# Altium schematic sheet TPS55340_Adjustable_SEPIC_Converter.SchDoc: +8V...20V Output SEPIC Converter
size A4
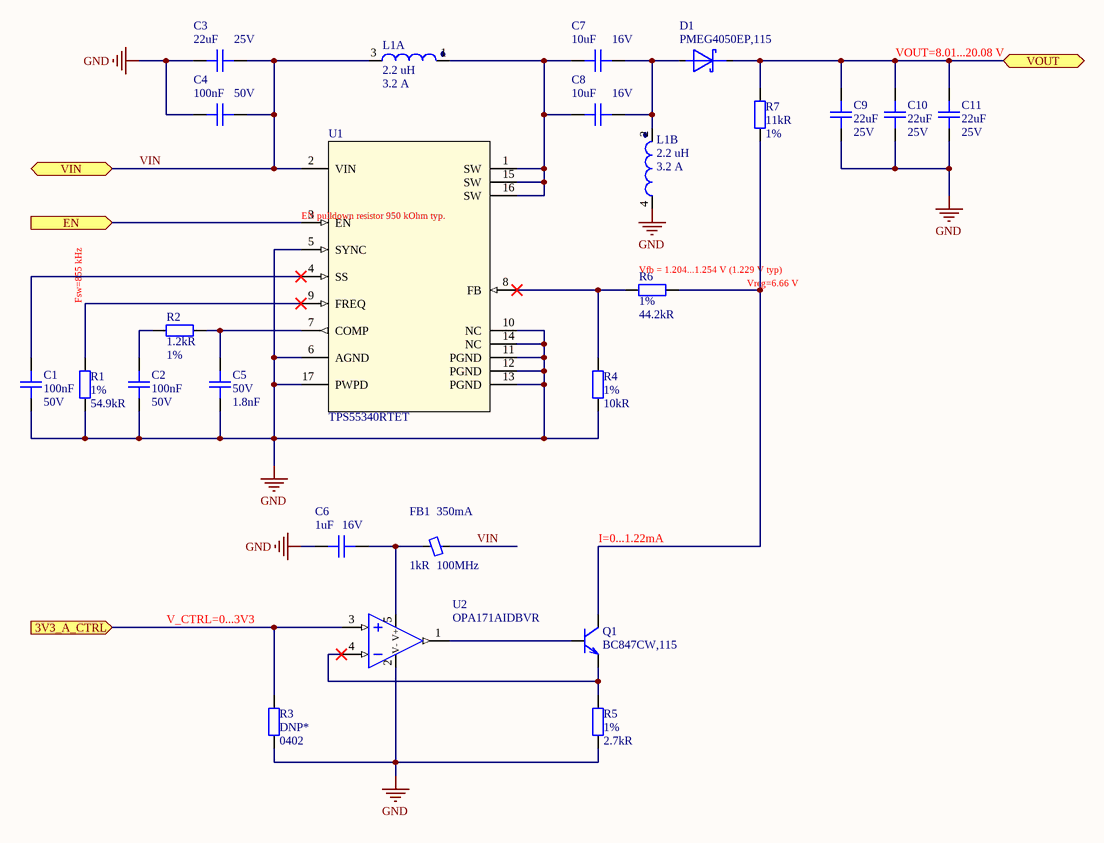
[diagram p0: TPS55340_Adjustable_SEPIC_Converter.SchDoc]

## Parts
C1  Capacitance: 100nF  Voltage: 50V  [C0402]  (hidden comment: CAP CER 0.1UF 50V X7R 0402)
C2  Capacitance: 100nF  Voltage: 50V  [C0402]  (hidden comment: CAP CER 0.1UF 50V X7R 0402)
C3  Capacitance: 22uF  Voltage Rating: 25V  [C0805]  (hidden comment: CAP CER 22UF 25V X5R 0805)
C4  Capacitance: 100nF  Voltage: 50V  [C0402]  (hidden comment: CAP CER 0.1UF 50V X7R 0402)
C5  Voltage Rating (DC): 50V  Capacitance: 1.8nF  [C0402]  (hidden comment: CAP CER 1800PF 50V X7R 0402)
C6  Capacitance: 1uF  Voltage Rating: 16V  [C0402]  (hidden comment: CAP CER 1UF 16V X5R 0402)
C7  Capacitance: 10uF  Voltage Rating: 16V  [C0805]  (hidden comment: CAP CER 10UF 16V X7R 0805)
C8  Capacitance: 10uF  Voltage Rating: 16V  [C0805]  (hidden comment: CAP CER 10UF 16V X7R 0805)
C9  Capacitance: 22uF  Voltage Rating: 25V  [C0805]  (hidden comment: CAP CER 22UF 25V X5R 0805)
C10  Capacitance: 22uF  Voltage Rating: 25V  [C0805]  (hidden comment: CAP CER 22UF 25V X5R 0805)
C11  Capacitance: 22uF  Voltage Rating: 25V  [C0805]  (hidden comment: CAP CER 22UF 25V X5R 0805)
D1  PMEG4050EP,115  [SOD-128]
FB1  Impedance: 1kR  Max DC Current: 350mA  Test Frequency: 100MHz  [L0402]  (hidden comment: FERRITE BEAD 1 KOHM 0402 1LN)
L1  Inductance: 2.2 uH  Maximum DC Current: 3.2 A  [IND_MSD1048H]  (hidden comment: FIXED IND COUIPLED 2.2UH 3.2A 22 MOHM SMD)  (parts A,B of 2)
Q1  BC847CW,115  [SOT-323]
R1  Tolerance: 1%  Resistance: 54.9kR  [R0402]  (hidden comment: RES SMD 54.9K OHM 1% 1/16W 0402)
R2  Resistance: 1.2kR  Tolerance: 1%  [R0402]  (hidden comment: RES SMD 1.2K OHM 1% 1/16W 0402)
R3  DNP*  Case/Package: 0402  [R0402]  (no BOM)
R4  Tolerance: 1%  Resistance: 10kR  [R0402]  (hidden comment: RES SMD 10K OHM 1% 1/16W 0402)
R5  Tolerance: 1%  Resistance: 2.7kR  [R0402]  (hidden comment: RES SMD 2.7K OHM 1% 1/16W 0402)
R6  Tolerance: 1%  Resistance: 44.2kR  [R0402]  (hidden comment: RES SMD 44.2K OHM 1% 1/16W 0402)
R7  Resistance: 11kR  Tolerance: 1%  [R0402]  (hidden comment: RES SMD 11K OHM 1% 1/16W 0402)
U1  TPS55340RTET  [RTE0016C]
U2  OPA171AIDBVR  [SOT-23-5]

## Ports
3V3_A_CTRL (in), EN (in), VIN, VOUT

## Nets
GND: C1.1 C2.1 C3.1 C4.1 C5.1 C6.1 C9.1 C10.1 C11.1 L1.4 R1.1 R3.2 R4.2 R5.1 U1.5(SYNC) U1.6(AGND) U1.10(NC) U1.11(PGND) U1.12(PGND) U1.13(PGND) U1.14(NC) U1.17(PWPD) U2.2(V-)
3V3_A_CTRL: R3.1 U2.3(IN+) ; port 3V3_A_CTRL
EN: U1.3(EN) ; port EN
VIN: C3.2 C4.2 FB1.1 L1.3 U1.2(VIN) ; port VIN
VOUT: C9.2 C10.2 C11.2 D1.1(K) R7.2 ; port VOUT
NetC1_2: C1.2 U1.4(SS)
NetC2_2: C2.2 R2.1
NetC5_2: C5.2 R2.2 U1.7(COMP)
NetC6_2: C6.2 FB1.2 U2.5(V+)
NetC7_1: C7.1 C8.1 L1.1 U1.1(SW) U1.15(SW) U1.16(SW)
NetC7_2: C7.2 C8.2 D1.2(A) L1.2
NetQ1_1: Q1.1(B) U2.1(OUT)
NetQ1_2: Q1.2(E) R5.2 U2.4(IN-)
NetQ1_3: Q1.3(C) R6.1 R7.1
NetR1_2: R1.2 U1.9(FREQ)
NetR4_1: R4.1 R6.2 U1.8(FB)

## Notes on the sheet
- VOUT=8.01...20.08 V
- (near U1) EN pulldown resistor 950 kOhm typ.
- (near R1) Fsw=855 kHz
- (near U1) Vfb = 1.204...1.254 V (1.229 V typ)
- (near R6) Vreg=6.66 V
- I=0...1.22mA
- V_CTRL=0...3V3
- Title
- Size:
- Date:
- A4
- Number:
- Time:
- Revision:
- Sheet
- of
- File:

## Library data of the parts
C1 C2 C4 = CAP CER 0.1UF 50V X7R 0402: 0.1µF ±10% 50V Ceramic Capacitor X7R 0402 (1005 Metric); Manufacturer: TDK; Manufacturer Part Number: CGA2B3X7R1H104K050BB; Supplier 1: Digi-Key; Stock 1: 2925303; Pricing 1: 1=0.17, 10=0.118, 50=0.0668, 100=0.0553, 500=0.0388, 1000=0.0321, 2500=0.0299, 5000=0.0273 (USD); Case/Package: 0402; Case Code (Imperial): 0402; Case Code (Metric): 1005; Min Operating Temperature: -55°C; Max Operating Temperature: 125°C; Packaging: Tape and Reel; Voltage Rating (DC): 50V; Package Quantity: 1; Voltage Rating: 50V; Termination: SMD/SMT; Composition: Ceramic; Length: 1mm; Height: 0.5mm; Width: 0.02inch; Depth: 0.5mm; Lead Free: Lead Free; ComponentLink1URL: http://product.tdk.com/capacitor/mlcc/en/documents/mlccspec_automotive_general_midvoltage_en.pdf?src-supplier=Future+Electronics; ComponentLink1Description: http://product.tdk.com/capacitor/mlcc/en/documents/mlccspec_automotive_general_midvoltage_en.pdf?src-supplier=Future+Electronics; Supplier Part Number 1: 445-6899-1-ND; Tolerance: 10%; Mount: Surface Mount; Weight: 2.3E-05oz; Dielectric: X7R; Thickness: 0.022inch; Ratings: AEC-Q200; REACH SVHC: No SVHC; ComponentLink2URL: http://www.farnell.com/datasheets/1807242.pdf?src-supplier=Element14; ComponentLink2Description: http://www.farnell.com/datasheets/1807242.pdf?src-supplier=Element14; ComponentLink3URL: http://www.mouser.com/ds/2/400/lcc_automotive_general_en-843974.pdf?src-supplier=Mouser; ComponentLink3Description: http://www.mouser.com/ds/2/400/lcc_automotive_general_en-843974.pdf?src-supplier=Mouser; ComponentLink4URL: http://www.farnell.com/datasheets/1936565.pdf?src-supplier=Element14; ComponentLink4Description: http://www.farnell.com/datasheets/1936565.pdf?src-supplier=Element14; ComponentLink5URL: http://www.farnell.com/datasheets/1735392.pdf?src-supplier=Element14; ComponentLink5Description: http://www.farnell.com/datasheets/1735392.pdf?src-supplier=Element14
C3 C9-C11 = CAP CER 22UF 25V X5R 0805: 22µF ±20% 25V Ceramic Capacitor X5R 0805 (2012 Metric); Manufacturer: Yageo; Manufacturer Part Number: CC0805MKX5R8BB226; Supplier 1: Digi-Key; Stock 1: 1060; Pricing 1: 1=0.5, 10=0.353, 50=0.267, 100=0.2325, 500=0.1722, 1000=0.1464 (USD); Mount: Surface Mount; Case/Package: 0805; Weight: 0.000194oz; Case Code (Metric): 2012; Case Code (Imperial): 0805; Min Operating Temperature: -55°C; Max Operating Temperature: 85°C; Packaging: Tape and Reel; Tolerance: 20%; Dielectric: X5R; Termination: SMD/SMT; Voltage Rating (DC): 25V; Package Quantity: 3000; Length: 0.079inch; Height: 1.25mm; Width: 0.049inch; Thickness: 0.057inch; Lead Free: Lead Free; Halogen Free: Halogen Free; ComponentLink1URL: http://www.yageo.com/documents/recent/UPY-GPHC_X5R_4V-to-50V_25.pdf?src-supplier=Digi-Key; ComponentLink1Description: http://www.yageo.com/documents/recent/UPY-GPHC_X5R_4V-to-50V_25.pdf?src-supplier=Digi-Key; ComponentLink2URL: http://www.mouser.com/ds/2/447/Yageo_UPY-GP_NP0_16V-to-50V_9-358835.pdf?src-supplier=Mouser; ComponentLink2Description: http://www.mouser.com/ds/2/447/Yageo_UPY-GP_NP0_16V-to-50V_9-358835.pdf?src-supplier=Mouser; Supplier Part Number 1: 311-1903-1-ND
C5 = CAP CER 1800PF 50V X7R 0402: 1800pF ±5% 50V Ceramic Capacitor X7R 0402 (1005 Metric); Manufacturer: KEMET; Manufacturer Part Number: C0402C182J5RACTU; Dissipation Factor: 2.5%; Supplier 1: Digi-Key; Stock 1: 45958; Pricing 1: 1=0.46, 10=0.322, 50=0.2438, 100=0.2124, 500=0.1573, 1000=0.1337, 2500=0.1258, 5000=0.118 (USD); Mount: Surface Mount; Case/Package: 0402; Case Code (Metric): 1005; Case Code (Imperial): 0402; Min Operating Temperature: -55°C; Max Operating Temperature: 125°C; Package Quantity: 1; Packaging: Tape and Reel; Tolerance: 5%; Dielectric: X7R; Termination: SMD/SMT; Length: 1mm; Height: 0.5mm; Width: 0.02inch; Thickness: 0.022inch; ComponentLink1URL: http://www.mouser.com/ds/2/212/KEM_C1002_X7R_SMD-1102033.pdf?src-supplier=Mouser; ComponentLink1Description: http://www.mouser.com/ds/2/212/KEM_C1002_X7R_SMD-1102033.pdf?src-supplier=Mouser; Supplier Part Number 1: 399-8953-1-ND; Voltage Rating: 50V; Dielectric Material: Ceramic; Depth: 0.5mm; REACH SVHC: No SVHC; Lead Pitch: 0.3mm; Radiation Hardening: No
C6 = CAP CER 1UF 16V X5R 0402: 1µF ±10% 16V Ceramic Capacitor X5R 0402 (1005 Metric); Manufacturer: Yageo; Manufacturer Part Number: CC0402KRX5R7BB105; Supplier 1: Digi-Key; Stock 1: 1114963; Pricing 1: 1=0.4, 10=0.278, 100=0.167, 500=0.1253, 1000=0.1058, 2500=0.1002, 5000=0.0947 (USD); Mount: Surface Mount; Case/Package: 0402; Weight: 2.3E-05oz; Case Code (Metric): 1005; Case Code (Imperial): 0402; Min Operating Temperature: -55°C; Max Operating Temperature: 85°C; Packaging: Tape and Reel; Tolerance: 10%; Voltage Rating (DC): 16V; Dielectric: X5R; Termination: SMD/SMT; Length: 1mm; Height: 0.5mm; Width: 0.02inch; Thickness: 0.022inch; Depth: 0.5mm; Lead Free: Lead Free; ComponentLink1URL: http://www.yageo.com/documents/recent/UPY-GPHC_X5R_4V-to-50V_12.pdf?src-supplier=Avnet+Europe; ComponentLink1Description: http://www.yageo.com/documents/recent/UPY-GPHC_X5R_4V-to-50V_12.pdf?src-supplier=Avnet+Europe; Supplier Part Number 1: 311-1691-1-ND; Composition: Ceramic; Radiation Hardening: No; Halogen Free: Halogen Free
C7 C8 = CAP CER 10UF 16V X7R 0805: 10µF ±10% 16V Ceramic Capacitor X7R 0805 (2012 Metric); Manufacturer: Samsung; Manufacturer Part Number: CL21B106KOQNNNG; Supplier 1: Digi-Key; Stock 1: 251380; Pricing 1: 1=0.3, 10=0.207, 100=0.1173, 500=0.0828, 1000=0.0725 (USD); Mount: Surface Mount; Case/Package: 0805; Case Code (Metric): 2012; Case Code (Imperial): 0805; Material: Ceramic; Min Operating Temperature: -55°C; Max Operating Temperature: 125°C; Tolerance: 10%; Packaging: Tape and Reel; Package Quantity: 3000; Length: 0.079inch; Width: 0.049inch; Thickness: 0.055inch; Depth: 1.25mm; Lead Free: Lead Free; ComponentLink1URL: http://www.samsungsem.com/kr/support/product-search/mlcc/CL21B106KOQNNNG.jsp?src-supplier=Digi-Key; ComponentLink1Description: http://www.samsungsem.com/kr/support/product-search/mlcc/CL21B106KOQNNNG.jsp?src-supplier=Digi-Key; ComponentLink2URL: https://produktinfo.conrad.com/datenblaetter/450000-474999/454918-da-01-en-VS_KONDENSATOR_0805.pdf?src-supplier=Conrad; ComponentLink2Description: https://produktinfo.conrad.com/datenblaetter/450000-474999/454918-da-01-en-VS_KONDENSATOR_0805.pdf?src-supplier=Conrad; Supplier Part Number 1: 1276-6472-1-ND; Dielectric: X7R
D1 = DIODE SCHOTTKY 40V 5A SOD128: Diode Schottky 40V 5A Surface Mount CFP5; Manufacturer: Nexperia; Type: Schottky Diode; Ir - Reverse Current: 300 uA; Qualification: AEC-Q101; Vf - Forward Voltage: 0.49 V; Configuration: Single; Ifsm - Forward Surge Current: 70 A; Supplier 1: Mouser; Manufacturer Part Number: PMEG4050EP,115; Stock 1: 39277; Pricing 1: 1=0.470, 10=0.346, 100=0.216, 1000=0.147, 3000=0.129, 9000=0.116, 24000=0.114, 45000=0.107, 99000=0.104 (USD); ComponentLink1URL: https://www.mouser.com/datasheet/2/916/PMEG4050EP-1320387.pdf; ComponentLink1Description: https://www.mouser.com/datasheet/2/916/PMEG4050EP-1320387.pdf; Supplier Part Number 1: 771-PMEG4050EP115; RoHS: RoHS Compliant; Category: Schottky Diodes & Rectifiers; Height: 1.1 mm; Length: 4 mm; Package / Case: SOD-128-2; Packaging: Cut Tape; Product: Schottky Diodes; Width: 2.7 mm; Brand: Nexperia; Mounting Style: SMD/SMT; If - Forward Current: 5 A; Maximum Operating Temperature: + 150 C; Minimum Operating Temperature: - 55 C; Product Type: Schottky Diodes & Rectifiers; Standard Pack Qty: 3000; Subcategory: Diodes & Rectifiers; RoHS - Mouser: Y; Minimum Order Quantity: 1; Reeling: True; Operating Temperature Range: + 150 C; Technology: Si; Vrrm - Repetitive Reverse Voltage: 40 V; Mount: Surface Mount
FB1 = FERRITE BEAD 1 KOHM 0402 1LN: 1 kOhms @ 100MHz 1  Ferrite Bead 0402 (1005 Metric) 350mA 490mOhm; Manufacturer: Murata; Manufacturer Part Number: BLM15AX102SN1D; Material: Ferrite,Steel; Tolerance: 25%; Number of Lines: 1; DC Resistance (DCR): 490mR; Supplier 1: Digi-Key; Stock 1: 138597; Pricing 1: 1=0.11, 10=0.09, 25=0.0812, 50=0.0596, 100=0.0514, 250=0.0406, 500=0.0343, 1000=0.0289, 5000=0.0257 (USD); Case/Package: 0402; Number of Pins: 2; Case Code (Metric): 1005; Case Code (Imperial): 0402; Min Operating Temperature: -55°C; Max Operating Temperature: 125°C; Package Quantity: 1; Packaging: Tape and Reel; Current Rating: 350mA; Max Current Rating: 350mA; Termination: SMD/SMT; Number of Circuits: 1; Length: 1mm; Height: 0.5mm; Width: 0.5mm; Depth: 0.5mm; REACH SVHC: No SVHC; Lead Free: Lead Free; ComponentLink1URL: https://www.murata.com/en-us/products/productdata/8796740059166/ENFA0018.pdf?src-supplier=Digi-Key; ComponentLink1Description: https://www.murata.com/en-us/products/productdata/8796740059166/ENFA0018.pdf?src-supplier=Digi-Key; ComponentLink2URL: http://search.murata.co.jp/Ceramy/image/img/PDF/ENG/L0110S0100BLM15AX_SN.pdf?src-supplier=Future+Electronics; ComponentLink2Description: http://search.murata.co.jp/Ceramy/image/img/PDF/ENG/L0110S0100BLM15AX_SN.pdf?src-supplier=Future+Electronics; ComponentLink3URL: http://www.produktinfo.conrad.com/datenblaetter/1100000-1199999/001171674-da-01-en-CHIP_DROSSEL0402_1000R_350MA_1_0X0_5MM.pdf?src-supplier=Conrad; ComponentLink3Description: http://www.produktinfo.conrad.com/datenblaetter/1100000-1199999/001171674-da-01-en-CHIP_DROSSEL0402_1000R_350MA_1_0X0_5MM.pdf?src-supplier=Conrad; ComponentLink4URL: http://www.produktinfo.conrad.com/datenblaetter/1100000-1199999/001172166-da-01-en-DROSSEL_0402_1000R_31_0X0_5MM_10000ST.pdf?src-supplier=Conrad; ComponentLink4Description: http://www.produktinfo.conrad.com/datenblaetter/1100000-1199999/001172166-da-01-en-DROSSEL_0402_1000R_31_0X0_5MM_10000ST.pdf?src-supplier=Conrad; Supplier Part Number 1: 490-5442-1-ND; Mount: Surface Mount
L1 = FIXED IND COUIPLED 2.2UH 3.2A 22 MOHM SMD: 2.2µH Shielded Coupled Inductors 3.2A 22mOhm Max 4040 (10.3x10.3 Metric); Manufacturer: Coilcraft; Manufacturer Part Number: MSD1048H-222; Tolerance: 30 %; Self Resonant Frequency: 55 MHz; Test Frequency: 100 kHz; Type: SMD Inductor; Packaging: Cut Tape; Shielding: Shielded; ComponentLink1URL: https://www.coilcraft.com/getmedia/492eebb2-11bb-49ba-b07b-44c830c73f93/msd1048h.pdf; ComponentLink1Description: https://www.coilcraft.com/en-us/products/power/coupled-inductors/1-1-shielded-coupled/msd_h/msd1048h/#; Category: Fixed Coupled Inductors; Application: Power; Height: 4.8 mm; Length: 10.3 mm; Maximum DC Resistance: 22 mOhms; Product: Power Inductors; Series: MSD1048H; Termination Style: SMD/SMT; Width: 10.3 mm; Brand: Coilcraft; Mounting Style: PCB Mount; Maximum Operating Temperature: + 125 C; Minimum Operating Temperature: - 40 C; Product Type: Fixed Coupled Inductors; Subcategory: Inductors, Chokes & Coils; Termination: -; Minimum Order Quantity: 1; Reeling: True; Mount: Surface Mount
Q1 = TRANS BC847CW,115 NPN 45V 0.1A SOT323: Bipolar (BJT) Transistor NPN 45V 100mA 100MHz 200mW Surface Mount SOT-323-3; Manufacturer: Nexperia; Supplier 1: Digi-Key; Manufacturer Part Number: BC847CW,115; Stock 1: 327256; Pricing 1: 1=0.13, 10=0.118, 25=0.1124, 100=0.0495, 250=0.0475, 500=0.0389, 1000=0.027 (USD); ComponentLink1URL: http://www.farnell.com/datasheets/1856333.pdf?src-supplier=Farnell; ComponentLink1Description: http://www.farnell.com/datasheets/1856333.pdf?src-supplier=Farnell; ComponentLink2URL: http://www.farnell.com/datasheets/1856333.pdf?src-supplier=Element14; ComponentLink2Description: http://www.farnell.com/datasheets/1856333.pdf?src-supplier=Element14; ComponentLink3URL: https://assets.nexperia.com/documents/data-sheet/BC847_SER.pdf?src-supplier=Digi-Key; ComponentLink3Description: https://assets.nexperia.com/documents/data-sheet/BC847_SER.pdf?src-supplier=Digi-Key; ComponentLink4URL: http://www.farnell.com/datasheets/1856333.pdf?src-supplier=Newark; ComponentLink4Description: http://www.farnell.com/datasheets/1856333.pdf?src-supplier=Newark; Supplier Part Number 1: 1727-4312-1-ND; Mount: Surface Mount
R1 = RES SMD 54.9K OHM 1% 1/16W 0402: 54.9 kOhms ±1% 0.063W, 1/16W Chip Resistor 0402 (1005 Metric) Moisture Resistant Thick Film; Manufacturer: Yageo; Manufacturer Part Number: RC0402FR-0754K9L; Power Rating: 62.5mW; Voltage Rating: 50V; Temperature Coefficient: 100ppm/°C; Max Power Dissipation: 63mW; Supplier 1: Digi-Key; Stock 1: 707322; Pricing 1: 1=0.1, 10=0.015, 100=0.0062, 1000=0.0028, 2500=0.0024, 5000=0.002 (USD); Case/Package: 0402; Case Code (Imperial): 0402; Case Code (Metric): 1005; Min Operating Temperature: -55°C; Max Operating Temperature: 155°C; Packaging: Tape and Reel; Termination: SMD/SMT; Military Standard: Not; Composition: Thick Film; Length: 1mm; Depth: 0.5mm; Lead Free: Lead Free; ComponentLink1URL: http://www.yageo.com/documents/recent/PYu-RC0402_51_RoHS_L_6.pdf?src-supplier=Avnet+Europe; ComponentLink1Description: http://www.yageo.com/documents/recent/PYu-RC0402_51_RoHS_L_6.pdf?src-supplier=Avnet+Europe; ComponentLink2URL: http://www.yageo.com/documents/recent/PYu-RC0402_51_RoHS_L_6_r.pdf?src-supplier=Future+Electronics; ComponentLink2Description: http://www.yageo.com/documents/recent/PYu-RC0402_51_RoHS_L_6_r.pdf?src-supplier=Future+Electronics; ComponentLink3URL: http://www.yageo.com/documents/recent/PYu-RC0402_51_RoHS_L_6_r.pdf?src-supplier=Mouser; ComponentLink3Description: http://www.yageo.com/documents/recent/PYu-RC0402_51_RoHS_L_6_r.pdf?src-supplier=Mouser; Supplier Part Number 1: YAG3185CT-ND; Contact Plating: Tin,Matte; Number of Terminations: 2; Voltage Rating (DC): 50V; Features: Moisture Resistant; Height: 0.016inch; Width: 0.02inch; Mount: Surface Mount
R2 = RES SMD 1.2K OHM 1% 1/16W 0402: 1.2 kOhms ±1% 0.063W, 1/16W Chip Resistor 0402 (1005 Metric) Moisture Resistant Thick Film; Manufacturer: Yageo; Manufacturer Part Number: RC0402FR-071K2L; Power Rating: 63mW; Temperature Coefficient: 100ppm/°C; Voltage Rating: 50V; Supplier 1: Digi-Key; Stock 1: 894472; Pricing 1: 1=0.1, 10=0.015, 100=0.0062, 1000=0.0028, 2500=0.0024, 5000=0.002 (USD); Case/Package: 0402; Case Code (Imperial): 0402; Case Code (Metric): 1005; Min Operating Temperature: -55°C; Max Operating Temperature: 155°C; Packaging: Tape and Reel; Termination: SMD/SMT; Composition: Thick Film; Number of Terminations: 2; Military Standard: Not; Max Power Dissipation: 63mW; Features: Moisture Resistant; Length: 1mm; Height: 0.016inch; Width: 0.02inch; Depth: 0.5mm; Lead Free: Lead Free; ComponentLink1URL: http://www.farnell.com/datasheets/2167052.pdf?src-supplier=Element14; ComponentLink1Description: http://www.farnell.com/datasheets/2167052.pdf?src-supplier=Element14; ComponentLink2URL: https://www.verical.com/server-webapp/html/getDatasheet?partID=323716&src-supplier=Verical; ComponentLink2Description: https://www.verical.com/server-webapp/html/getDatasheet?partID=323716&src-supplier=Verical; Supplier Part Number 1: 311-1.20KLRCT-ND; ComponentLink3URL: http://documents.rs-components.com/techlib://itc_doclist_GB.htm?stockno=6186138&src-supplier=RSComponents; ComponentLink3Description: http://documents.rs-components.com/techlib://itc_doclist_GB.htm?stockno=6186138&src-supplier=RSComponents; Package Quantity: 1; REACH SVHC: Unknown; ComponentLink4URL: http://www.yageo.com/documents/recent/PYu-RC_Group_51_RoHS_L_10.pdf?src-supplier=Digi-Key; ComponentLink4Description: http://www.yageo.com/documents/recent/PYu-RC_Group_51_RoHS_L_10.pdf?src-supplier=Digi-Key; ComponentLink5URL: http://www.yageo.com/documents/recent/PYu-RC_Group_51_RoHS_L_9.pdf?src-supplier=Digi-Key; ComponentLink5Description: http://www.yageo.com/documents/recent/PYu-RC_Group_51_RoHS_L_9.pdf?src-supplier=Digi-Key; ComponentLink6URL: http://www.yageo.com/documents/recent/PYu-RC0402_51_RoHS_L_6_r.pdf?src-supplier=Future+Electronics; ComponentLink6Description: http://www.yageo.com/documents/recent/PYu-RC0402_51_RoHS_L_6_r.pdf?src-supplier=Future+Electronics; Mount: Surface Mount
R3 = RES SMD NO BOM 0402: Placeholder for a 0402 resistor
R4 = RES SMD 10K OHM 1% 1/16W 0402: 10 kOhms ±1% 0.063W, 1/16W Chip Resistor 0402 (1005 Metric) Moisture Resistant Thick Film; Manufacturer: Yageo; Manufacturer Part Number: RC0402FR-0710KP; Temperature Coefficient: 150ppm/°C; Max Power Dissipation: 63mW; Supplier 1: Digi-Key; Stock 1: 839368; Pricing 1: 1=0.1, 10=0.035, 100=0.014, 1000=0.0063, 2500=0.0055, 5000=0.0045 (USD); Case/Package: 0402; Case Code (Imperial): 0402; Case Code (Metric): 1005; Min Operating Temperature: -55°C; Max Operating Temperature: 155°C; Packaging: Tape and Reel; Composition: Thick Film; Number of Terminations: 2; Features: Moisture Resistant; Length: 0.039inch; Height: 0.016inch; Width: 0.02inch; ComponentLink1URL: http://www.yageo.com/NewPortal/yageodocoutput?fileName=/pdf/R-Chip/PYu-RC_51_RoHS_P_0.pdf&src-supplier=Digi-Key; ComponentLink1Description: http://www.yageo.com/NewPortal/yageodocoutput?fileName=/pdf/R-Chip/PYu-RC_51_RoHS_P_0.pdf&src-supplier=Digi-Key; Supplier Part Number 1: YAG1249CT-ND; Mount: Surface Mount
R5 = RES SMD 2.7K OHM 1% 1/16W 0402: 2.7 kOhms ±1% 0.063W, 1/16W Chip Resistor 0402 (1005 Metric) Moisture Resistant Thick Film; Manufacturer: Yageo; Manufacturer Part Number: RC0402FR-072K7L; Power Rating: 63mW; Voltage Rating: 50V; Temperature Coefficient: 100ppm/°C; Supplier 1: Digi-Key; Stock 1: 261850; Pricing 1: 1=0.1, 10=0.016, 100=0.0064, 1000=0.0029, 2500=0.0025, 5000=0.0021 (USD); Case/Package: 0402; Case Code (Metric): 1005; Case Code (Imperial): 0402; Min Operating Temperature: -55°C; Max Operating Temperature: 155°C; Package Quantity: 1; Packaging: Tape and Reel; Composition: Thick Film; Number of Terminations: 2; Termination: SMD/SMT; Military Standard: Not; Max Power Dissipation: 63mW; Working Voltage: 50V; Features: Moisture Resistant; Length: 1mm; Height: 0.016inch; Width: 0.02inch; Depth: 0.5mm; REACH SVHC: Unknown; Lead Free: Lead Free; ComponentLink1URL: http://www.mouser.com/ds/2/447/PYu-RC0402_51_RoHS_L_6_r-8721.pdf?src-supplier=Mouser; ComponentLink1Description: http://www.mouser.com/ds/2/447/PYu-RC0402_51_RoHS_L_6_r-8721.pdf?src-supplier=Mouser; ComponentLink2URL: http://www.yageo.com/documents/recent/PYu-RC_Group_51_RoHS_L_9.pdf?src-supplier=Digi-Key; ComponentLink2Description: http://www.yageo.com/documents/recent/PYu-RC_Group_51_RoHS_L_9.pdf?src-supplier=Digi-Key; ComponentLink3URL: http://www.yageo.com/documents/recent/PYu-RC_Group_51_RoHS_L_10.pdf?src-supplier=Digi-Key; ComponentLink3Description: http://www.yageo.com/documents/recent/PYu-RC_Group_51_RoHS_L_10.pdf?src-supplier=Digi-Key; ComponentLink4URL: http://www.farnell.com/datasheets/2167052.pdf?src-supplier=Element14; ComponentLink4Description: http://www.farnell.com/datasheets/2167052.pdf?src-supplier=Element14; Supplier Part Number 1: 311-2.70KLRCT-ND; Mount: Surface Mount
R6 = RES SMD 44.2K OHM 1% 1/16W 0402: 44.2 kOhms ±1% 0.063W, 1/16W Chip Resistor 0402 (1005 Metric) Moisture Resistant Thick Film; Manufacturer: Yageo; Manufacturer Part Number: RC0402FR-0744K2L; Temperature Coefficient: 100ppm/°C; Max Power Dissipation: 63mW; Power Rating: 62.5mW; Voltage Rating (DC): 50V; Supplier 1: Digi-Key; Stock 1: 66217; Pricing 1: 1=0.1, 10=0.015, 100=0.0062, 1000=0.0028, 2500=0.0024, 5000=0.002 (USD); Case/Package: 0402; Case Code (Imperial): 0402; Case Code (Metric): 1005; Min Operating Temperature: -55°C; Max Operating Temperature: 155°C; Packaging: Tape and Reel; Composition: Thick Film; Number of Terminations: 2; Features: Moisture Resistant; Length: 0.039inch; Height: 0.016inch; Width: 0.02inch; ComponentLink1URL: http://www.yageo.com/documents/recent/PYu-RC0402_51_RoHS_L_6.pdf?src-supplier=Avnet+Europe; ComponentLink1Description: http://www.yageo.com/documents/recent/PYu-RC0402_51_RoHS_L_6.pdf?src-supplier=Avnet+Europe; Supplier Part Number 1: YAG3163CT-ND; Contact Plating: Tin,Matte; ComponentLink2URL: http://www.yageo.com/documents/recent/PYu-RC0402_51_RoHS_L_6.pdf?src-supplier=Avnet; ComponentLink2Description: http://www.yageo.com/documents/recent/PYu-RC0402_51_RoHS_L_6.pdf?src-supplier=Avnet; ComponentLink3URL: http://www.mouser.com/ds/2/447/PYu-RC0402_51_RoHS_L_6_r-8721.pdf?src-supplier=Mouser; ComponentLink3Description: http://www.mouser.com/ds/2/447/PYu-RC0402_51_RoHS_L_6_r-8721.pdf?src-supplier=Mouser; Military Standard: Not; Depth: 0.5mm; Lead Free: Lead Free; Voltage Rating: 50V; Termination: SMD/SMT; Working Voltage: 50V; ComponentLink4URL: http://www.yageo.com/documents/recent/PYu-RC0402_51_RoHS_L_6_r.pdf?src-supplier=Future+Electronics; ComponentLink4Description: http://www.yageo.com/documents/recent/PYu-RC0402_51_RoHS_L_6_r.pdf?src-supplier=Future+Electronics; Mount: Surface Mount
R7 = RES SMD 11K OHM 1% 1/16W 0402: 11 kOhms ±1% 0.063W, 1/16W Chip Resistor 0402 (1005 Metric) Moisture Resistant Thick Film; Manufacturer: Yageo; Manufacturer Part Number: RC0402FR-0711KL; Temperature Coefficient: 100ppm/°C; Max Power Dissipation: 63mW; Voltage Rating: 50V; Supplier 1: Digi-Key; Stock 1: 632376; Pricing 1: 1=0.1, 10=0.015, 100=0.0062, 1000=0.0028, 2500=0.0024, 5000=0.002 (USD); Case/Package: 0402; Case Code (Imperial): 0402; Case Code (Metric): 1005; Min Operating Temperature: -55°C; Max Operating Temperature: 155°C; Packaging: Tape and Reel; Composition: Thick Film; Number of Terminations: 2; Length: 0.039inch; Height: 0.016inch; Width: 0.02inch; ComponentLink1URL: http://www.yageo.com/documents/recent/PYu-RC_Group_51_RoHS_L_10.pdf?src-supplier=Digi-Key; ComponentLink1Description: http://www.yageo.com/documents/recent/PYu-RC_Group_51_RoHS_L_10.pdf?src-supplier=Digi-Key; Supplier Part Number 1: 311-11.0KLRCT-ND; Features: Moisture Resistant; Number of Pins: 2; Power Rating: 63mW; Termination: SMD/SMT; Military Standard: Not; Voltage Rating (DC): 50V; Package Quantity: 1; Depth: 0.5mm; REACH SVHC: No SVHC; Lead Free: Lead Free; ComponentLink2URL: http://www.yageo.com/documents/recent/PYu-RC_Group_51_RoHS_L_9.pdf?src-supplier=Digi-Key; ComponentLink2Description: http://www.yageo.com/documents/recent/PYu-RC_Group_51_RoHS_L_9.pdf?src-supplier=Digi-Key; ComponentLink3URL: http://www.mouser.com/ds/2/447/PYu-RC0402_51_RoHS_L_6_r-8721.pdf?src-supplier=Mouser; ComponentLink3Description: http://www.mouser.com/ds/2/447/PYu-RC0402_51_RoHS_L_6_r-8721.pdf?src-supplier=Mouser; ComponentLink4URL: http://www.farnell.com/datasheets/1018594.pdf?src-supplier=Farnell; ComponentLink4Description: http://www.farnell.com/datasheets/1018594.pdf?src-supplier=Farnell; Mount: Surface Mount
U1 = IC TPS55340RTET REG BOOST ADJ 5.25A 16WQFN: Boost Switching Regulator IC Positive, Isolation Capable Adjustable 2.9V 1 Output 5.25A (Switch) 16-WFQFN Exposed Pad; Manufacturer: Texas Instruments; Topology: Boost,Flyback,SEPIC; Number of Outputs: 1; Max Input Voltage: 32V; Max Output Voltage: 38V; Output Current: 5A; Switching Frequency: 1.14MHz; Synchronous Rectifier: No; Quiescent Current: 500uA; Supplier 1: Digi-Key; Manufacturer Part Number: TPS55340RTET; Stock 1: 6832; Pricing 1: 1=3.76, 10=3.372, 25=3.1884, 100=2.6215 (USD); Mount: Surface Mount; Number of Pins: 16; Min Operating Temperature: -40°C; Max Operating Temperature: 150°C; Output Type: Adjustable; Packaging: Tape and Reel; Min Input Voltage: 2.9V; Min Output Voltage: 2.9V; ComponentLink1URL: http://www.ti.com/general/docs/lit/getliterature.tsp?genericPartNumber=TPS55340&amp;&amp;fileType=pdf&src-supplier=Newark; ComponentLink1Description: http://www.ti.com/general/docs/lit/getliterature.tsp?genericPartNumber=TPS55340&amp;&amp;fileType=pdf&src-supplier=Newark; Supplier Part Number 1: 296-30530-1-ND; ComponentLink2URL: http://www.ti.com/general/docs/lit/getliterature.tsp?genericPartNumber=TPS55340&&fileType=pdf&src-supplier=Avnet; ComponentLink2Description: http://www.ti.com/general/docs/lit/getliterature.tsp?genericPartNumber=TPS55340&&fileType=pdf&src-supplier=Avnet; Output Voltage: 38V; Max Output Current: 5A; Lead Free: Lead Free; ComponentLink3URL: http://www.farnell.com/datasheets/2019229.pdf?src-supplier=Element14; ComponentLink3Description: http://www.farnell.com/datasheets/2019229.pdf?src-supplier=Element14; ComponentLink4URL: http://www.ti.com/lit/ds/symlink/tps55340.pdf?src-supplier=Avnet+Europe; ComponentLink4Description: http://www.ti.com/lit/ds/symlink/tps55340.pdf?src-supplier=Avnet+Europe; Package Quantity: 1; Length: 3.15mm; Height: 0.72mm; Width: 3.15mm; Radiation Hardening: No; REACH SVHC: No SVHC
U2 = IC OPA171 OPAMP GP 1 CIRCUIT SOT-23-5: General Purpose Amplifier 1 Circuit Rail-to-Rail SOT-23-5; Manufacturer: Texas Instruments; Min Supply Voltage: 2.7V; Max Supply Voltage: 36V; Min Dual Supply Voltage: 1.35V; Max Dual Supply Voltage: 18V; Voltage Gain: 130dB; Output Current: 25mA; Nominal Supply Current: 475uA; Unity Gain Bandwidth Product: 3MHz; Common Mode Rejection Ratio: 104dB; Number of Channels: 1; Slew Rate: 1.5V/µs; Max I/O Voltage: 1.8mV; Input Bias Current: 15pA; Input Offset Voltage (Vos): 250uV; Output Current per Channel: 35mA; Power Supply Rejection Ratio (PSRR): 120dB; ComponentLink1URL: http://www.ti.com/lit/ds/symlink/opa171.pdf?src-supplier=Digi-Key; ComponentLink1Description: http://www.ti.com/lit/ds/symlink/opa171.pdf?src-supplier=Digi-Key; Supplier 1: Digi-Key; Manufacturer Part Number: OPA171AIDBVR; Stock 1: 126525; Pricing 1: 1=1.36, 10=1.215, 100=0.9476, 500=0.7828, 1000=0.618 (USD); Case/Package: SOT-23-5; Number of Pins: 5; Contact Plating: Gold; Min Operating Temperature: -40°C; Max Operating Temperature: 125°C; Package Quantity: 3000; Packaging: Tape and Reel; Nominal Gain Bandwidth Product: 3MHz; Number of Circuits: 1; Gain Bandwidth Product: 3MHz; Operating Supply Current: 475uA; Number of Elements: 1; Bandwidth: 3MHz; Number of Amplifiers: 1; Operating Supply Voltage: 18V; Radiation Hardening: No; REACH SVHC: No SVHC; Lead Free: Lead Free; Supplier Part Number 1: 296-37698-1-ND; Mount: Surface Mount